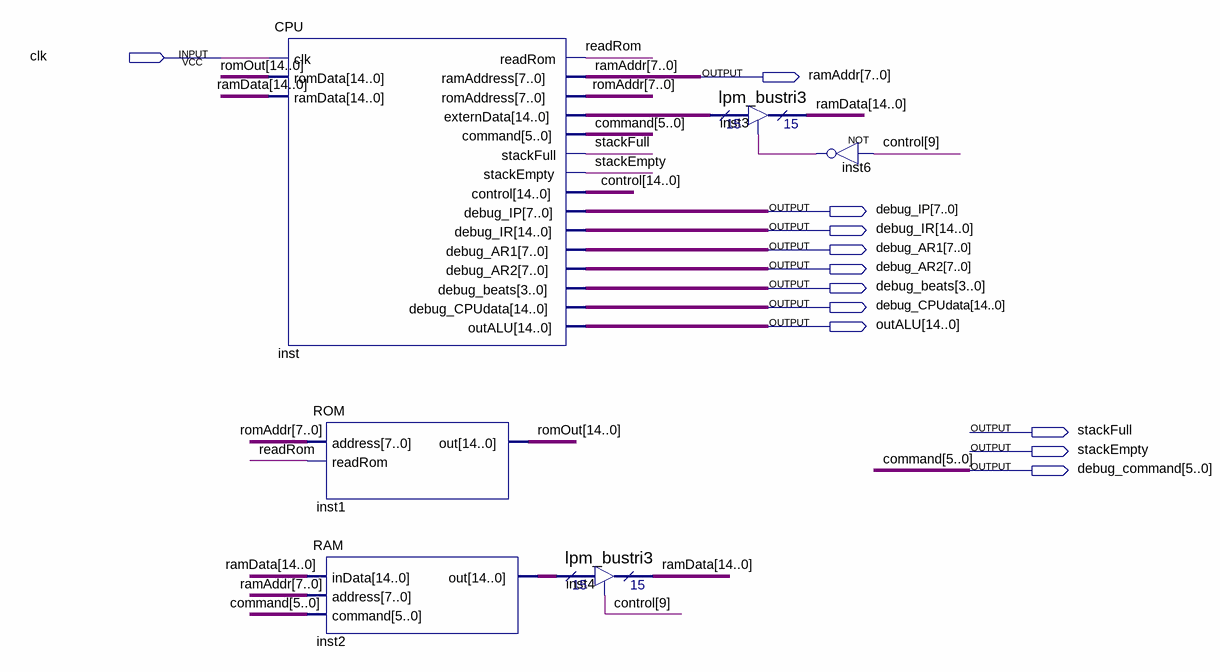
[diagram p0: schematic sheet]
// Quartus schematic main.bdf as structural Verilog: 6 symbols, 12 pins
module main (
  input  clk,
  output [7:0] ramAddr,
  output [7:0] debug_IP,
  output [14:0] debug_IR,
  output [7:0] debug_AR1,
  output [7:0] debug_AR2,
  output [3:0] debug_beats,
  output [14:0] debug_CPUdata,
  output [14:0] outALU,
  output stackFull,
  output stackEmpty,
  output [5:0] debug_command
);

  wire inst6_out, readRom;
  wire [7:0] romAddr;
  wire [14:0] control, inst2_out, inst_externdata, ramData, romOut;

  CPU inst (
    .clk(clk), .romData(romOut), .ramData(ramData), .readRom(readRom), .ramAddress(ramAddr),
    .romAddress(romAddr), .externData(inst_externdata), .command(debug_command), .stackFull(stackFull),
    .stackEmpty(stackEmpty), .control(control), .debug_IP(debug_IP), .debug_IR(debug_IR),
    .debug_AR1(debug_AR1), .debug_AR2(debug_AR2), .debug_beats(debug_beats), .debug_CPUdata(debug_CPUdata),
    .outALU(outALU));
  ROM inst1 (.address(romAddr), .readRom(readRom), .out(romOut));
  RAM inst2 (.inData(ramData), .address(ramAddr), .command(debug_command), .out(inst2_out));
  lpm_bustri3 inst4 (.enabledt(control[9]), .data(inst2_out), .tridata(ramData));
  lpm_bustri3 inst3 (.enabledt(inst6_out), .data(inst_externdata), .tridata(ramData));
  not inst6 (inst6_out, control[9]);

  // Other names for the same wires on the sheet: command[5:0] = debug_command
endmodule
